# EasyEDA schematic SCH_SilikonFM_2024-07-02.json
TITLE: SiliconFM; REV: 1.0; Date: 2024-07-02; Sheet: 1/1; Drawn By: mswietlicki; Company: Mateusz Świetlicki
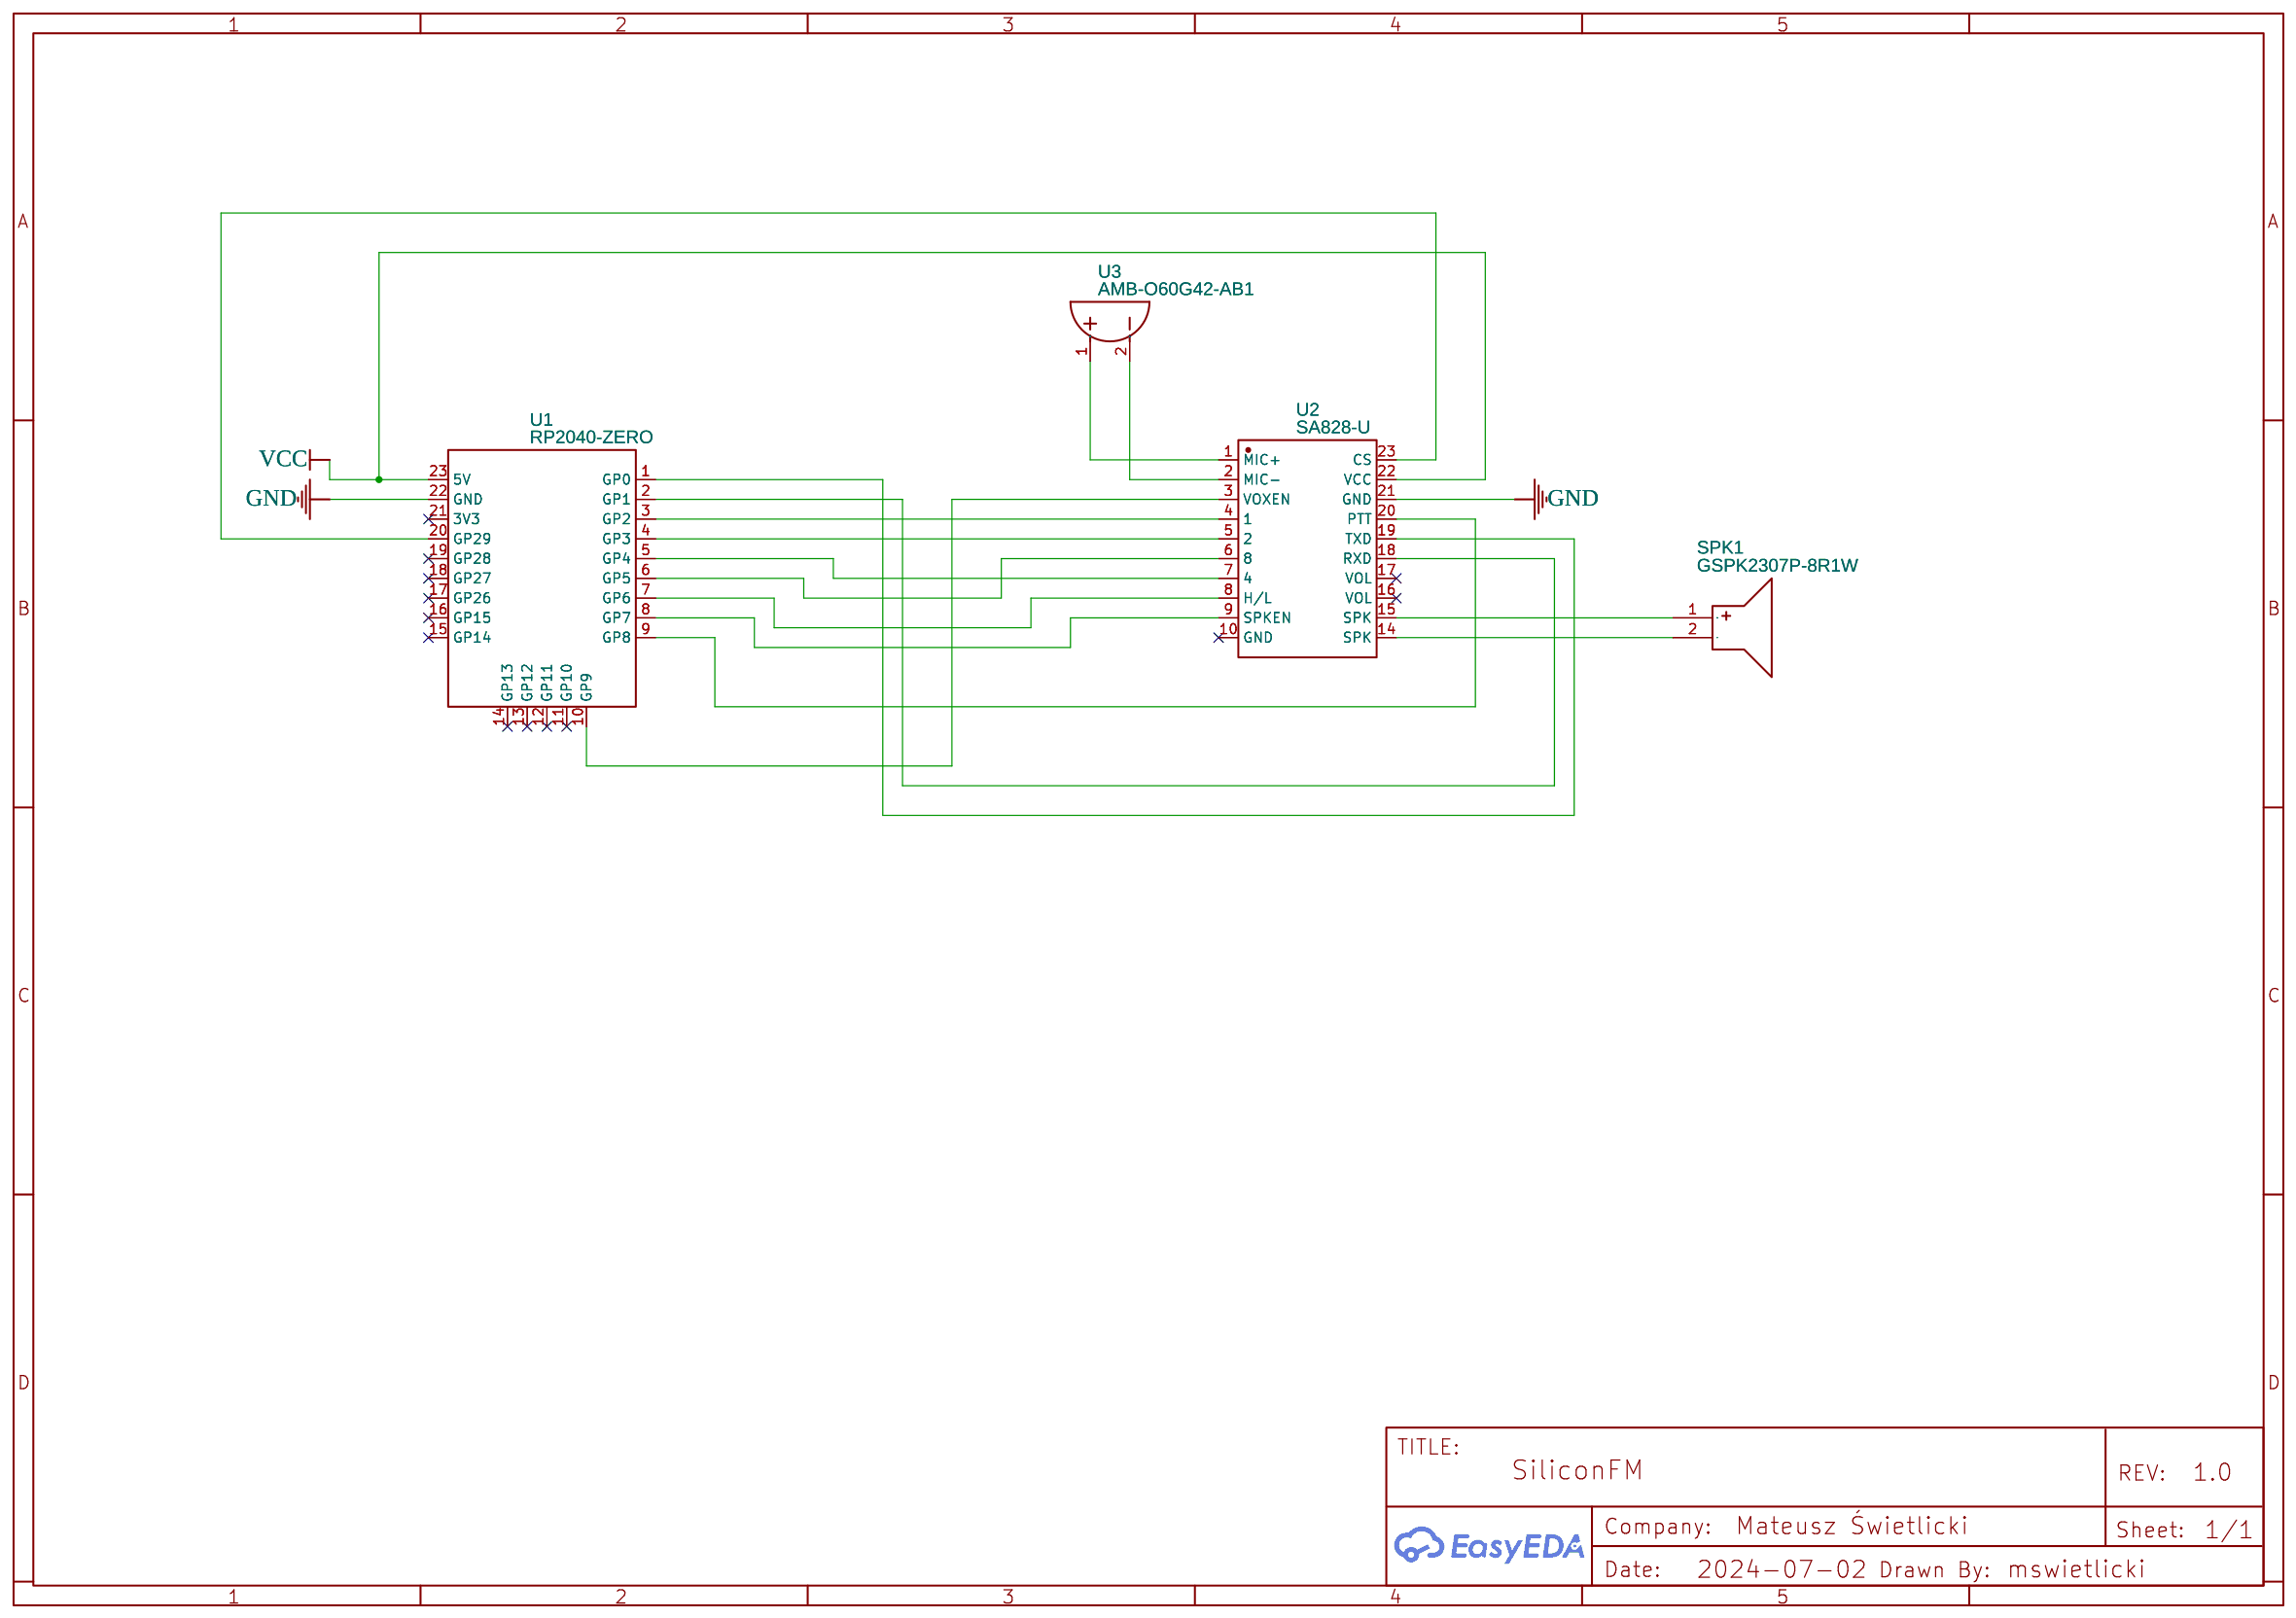
[diagram p0: schematic sheet]

## Parts
SPK1  GSPK2307P-8R1W  [SPK-TH_BD23.0-P10.00-D0.8-L-RD]
U1  RP2040-ZERO  [COMM-SMD_RP2040-ZERO]
U2  SA828-U  [WIRELM-TH_G-NICERF_SA828-X]
U3  AMB-O60G42-AB1  [MIC-TH_BD6.0-P1.90-D0.4-L-1]

## Library data of the parts
SPK1 = GSPK2307P-8R1W: Contributor: LCSC; Supplier: LCSC; Supplier Part: C530531; Manufacturer: INGHAi(赢海); JLCPCB Part Class: Extended Part
U1 = RP2040-ZERO: Supplier: LCSC; Supplier Part: C5350143; Manufacturer: Waveshare(微雪电子); Manufacturer Part: RP2040-Zero; JLCPCB Part Class: Extended Part; Contributor: lcsc
U2 = SA828-U: Contributor: lcsc; Supplier: LCSC; Supplier Part: C3001505; Manufacturer: G-NiceRF(思为无线); JLCPCB Part Class: Extended Part
U3 = AMB-O60G42-AB1: Supplier: LCSC; Supplier Part: C20200112; Manufacturer: Dragonstate(华龙); Contributor: lcsc; JLCPCB Part Class: Extended Part

## Nets
GND: U1.22(GND) U2.21(GND)
VCC: U1.23(5V) U2.22(VCC)
Net-(SPK1-1): SPK1.1(+) U2.15(SPK)
Net-(SPK1-2): SPK1.2(-) U2.14(SPK)
Net-(U1-1): U1.1(GP0) U2.19(TXD)
Net-(U1-2): U1.2(GP1) U2.18(RXD)
Net-(U1-3): U1.3(GP2) U2.4(1)
Net-(U1-4): U1.4(GP3) U2.5(2)
Net-(U1-5): U1.5(GP4) U2.7(4)
Net-(U1-6): U1.6(GP5) U2.6(8)
Net-(U1-7): U1.7(GP6) U2.8(H/L)
Net-(U1-8): U1.8(GP7) U2.9(SPKEN)
Net-(U1-9): U1.9(GP8) U2.20(PTT)
Net-(U1-10): U1.10(GP9) U2.3(VOXEN)
Net-(U1-20): U1.20(GP29) U2.23(CS)
Net-(U2-1): U2.1(MIC+) U3.1
Net-(U2-2): U2.2(MIC-) U3.2

Not connected (* = marked no-connect by the designer): U1 11(GP10)* 12(GP11)* 13(GP12)* 14(GP13)* 15(GP14)* 16(GP15)* 17(GP26)* 18(GP27)* 19(GP28)* 21(3V3)*; U2 10(GND)* 16(VOL)* 17(VOL)*
